# EAGLE schematic usb-digital-out (EAGLE 6.4)
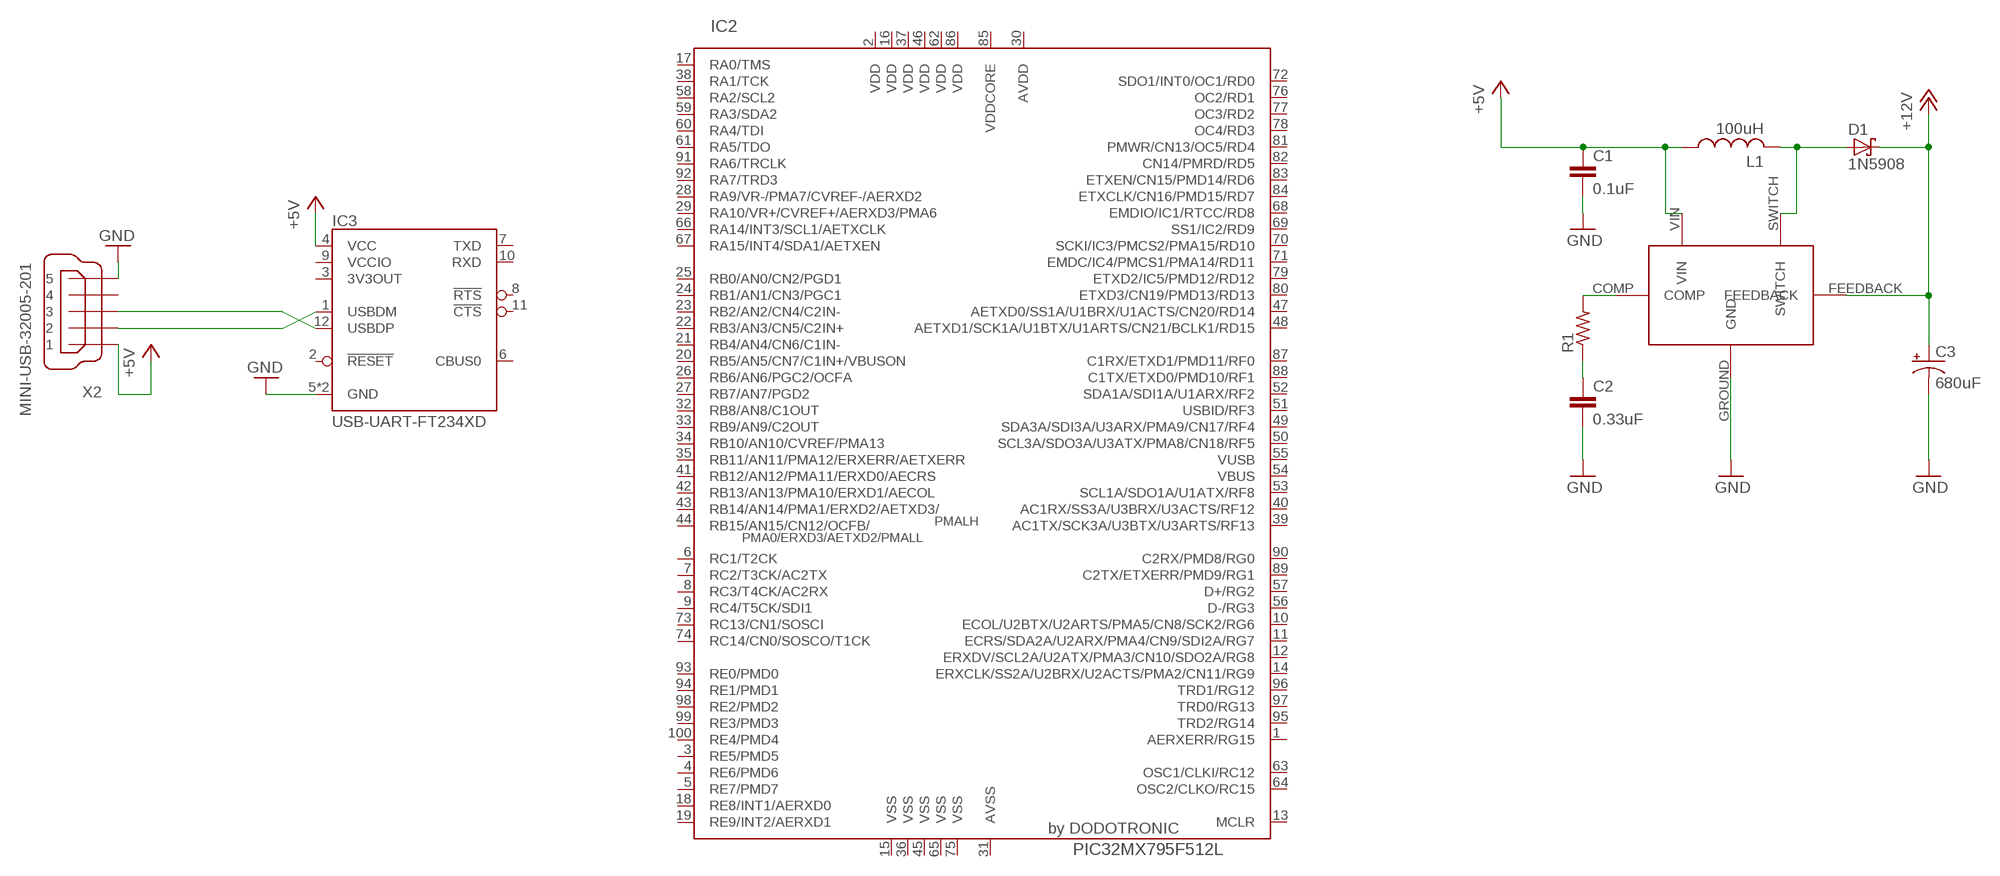
[diagram p0: schematic, sheet 1]

## Parts
C1  0.1uF  C-EUC0805K  [C0805K]
C2  0.33uF  C-EUC0805K  [C0805K]
C3  680uF  CPOL-USC/6032-28R  [C/6032-28R]
D1  1N5908  [C4111-15]
IC2  PIC32MX795F512L  [TQFP100_14X14]
IC3  USB-UART-FT234XD  [DFN-12-(3X3)]
L1  100uH  L-USL4532P  [L4532P]
R1  R-US_M0805  [M0805]
U$1  LM2577  [DDPAK-5]
X2  MINI-USB-32005-201  [32005-201]

## Nets
+5V: C1.1 IC3.4(VCC) L1.1 U$1.VIN X2.1
+12V: C3.+ D1.C U$1.FEEDBACK
GND: C1.2 C2.2 C3.- IC3.5(GND) IC3.THERMAL-PAD(GND) U$1.GROUND(GND) X2.5
N$1: C2.1 R1.1
N$2: R1.2 U$1.COMP
N$3: D1.A L1.2 U$1.SWITCH
N$4: IC3.1(USBDM) X2.2
N$5: IC3.12(USBDP) X2.3
Unconnected: IC2.1(AERXERR/RG15) IC2.3(RE5/PMD5) IC2.4(RE6/PMD6) IC2.5(RE7/PMD7) IC2.6(RC1/T2CK) IC2.7(RC2/T3CK/AC2TX) IC2.8(RC3/T4CK/AC2RX) IC2.9(RC4/T5CK/SDI1) IC2.10(ECOL/U2BTX/U2ARTS/PMA5/CN8/SCK2/RG6) IC2.11(ECRS/SDA2A/U2ARX/PMA4/CN9/SDI2A/RG7) IC2.12(ERXDV/SCL2A/U2ATX/PMA3/CN10/SDO2A/RG8) IC2.13(MCLR) IC2.14(ERXCLK/SS2A/U2BRX/U2ACTS/PMA2/CN11/RG9) IC2.17(RA0/TMS) IC2.18(RE8/INT1/AERXD0) IC2.19(RE9/INT2/AERXD1) IC2.20(RB5/AN5/CN7/C1IN+/VBUSON) IC2.21(RB4/AN4/CN6/C1IN-) IC2.22(RB3/AN3/CN5/C2IN+) IC2.23(RB2/AN2/CN4/C2IN-) IC2.24(RB1/AN1/CN3/PGC1) IC2.25(RB0/AN0/CN2/PGD1) IC2.26(RB6/AN6/PGC2/OCFA) IC2.27(RB7/AN7/PGD2) IC2.28(RA9/VR-/PMA7/CVREF-/AERXD2) IC2.29(RA10/VR+/CVREF+/AERXD3/PMA6) IC2.30(AVDD) IC2.31(AVSS) IC2.32(RB8/AN8/C1OUT) IC2.33(RB9/AN9/C2OUT) IC2.34(RB10/AN10/CVREF/PMA13) IC2.35(RB11/AN11/PMA12/ERXERR/AETXERR) IC2.38(RA1/TCK) IC2.39(AC1TX/SCK3A/U3BTX/U3ARTS/RF13) IC2.40(AC1RX/SS3A/U3BRX/U3ACTS/RF12) IC2.41(RB12/AN12/PMA11/ERXD0/AECRS) IC2.42(RB13/AN13/PMA10/ERXD1/AECOL) IC2.43(RB14/AN14/PMA1/ERXD2/AETXD3/) IC2.44(RB15/AN15/CN12/OCFB/) IC2.47(AETXD0/SS1A/U1BRX/U1ACTS/CN20/RD14) IC2.48(AETXD1/SCK1A/U1BTX/U1ARTS/CN21/BCLK1/RD15) IC2.49(SDA3A/SDI3A/U3ARX/PMA9/CN17/RF4) IC2.50(SCL3A/SDO3A/U3ATX/PMA8/CN18/RF5) IC2.51(USBID/RF3) IC2.52(SDA1A/SDI1A/U1ARX/RF2) IC2.53(SCL1A/SDO1A/U1ATX/RF8) IC2.54(VBUS) IC2.55(VUSB) IC2.56(D-/RG3) IC2.57(D+/RG2) IC2.58(RA2/SCL2) IC2.59(RA3/SDA2) IC2.60(RA4/TDI) IC2.61(RA5/TDO) IC2.63(OSC1/CLKI/RC12) IC2.64(OSC2/CLKO/RC15) IC2.66(RA14/INT3/SCL1/AETXCLK) IC2.67(RA15/INT4/SDA1/AETXEN) IC2.68(EMDIO/IC1/RTCC/RD8) IC2.69(SS1/IC2/RD9) IC2.70(SCKI/IC3/PMCS2/PMA15/RD10) IC2.71(EMDC/IC4/PMCS1/PMA14/RD11) IC2.72(SDO1/INT0/OC1/RD0) IC2.73(RC13/CN1/SOSCI) IC2.74(RC14/CN0/SOSCO/T1CK) IC2.76(OC2/RD1) IC2.77(OC3/RD2) IC2.78(OC4/RD3) IC2.79(ETXD2/IC5/PMD12/RD12) IC2.80(ETXD3/CN19/PMD13/RD13) IC2.81(PMWR/CN13/OC5/RD4) IC2.82(CN14/PMRD/RD5) IC2.83(ETXEN/CN15/PMD14/RD6) IC2.84(ETXCLK/CN16/PMD15/RD7) IC2.85(VDDCORE) IC2.87(C1RX/ETXD1/PMD11/RF0) IC2.88(C1TX/ETXD0/PMD10/RF1) IC2.89(C2TX/ETXERR/PMD9/RG1) IC2.90(C2RX/PMD8/RG0) IC2.91(RA6/TRCLK) IC2.92(RA7/TRD3) IC2.93(RE0/PMD0) IC2.94(RE1/PMD1) IC2.95(TRD2/RG14) IC2.96(TRD1/RG12) IC2.97(TRD0/RG13) IC2.98(RE2/PMD2) IC2.99(RE3/PMD3) IC2.100(RE4/PMD4) IC3.2(!RESET) IC3.6(CBUS0) IC3.7(TXD) IC3.8(!RTS) IC3.10(RXD) IC3.11(!CTS) X2.4

## Power pins joined to a net without a drawn wire
3V3OUT: IC3.3(3V3OUT)
VCCIO: IC3.9(VCCIO)
VDD: IC2.2(VDD) IC2.16(VDD) IC2.37(VDD) IC2.46(VDD) IC2.62(VDD) IC2.86(VDD)
VSS: IC2.15(VSS) IC2.36(VSS) IC2.45(VSS) IC2.65(VSS) IC2.75(VSS)

## Library data of the parts
C1 C2 = resistor:C-EU: CAPACITOR, European symbol
C3 = resistor:CPOL-US: POLARIZED CAPACITOR, American symbol
D1 = diode:1N5908: DIODE schottky
IC2 = DodoMicroR3:PIC32MX795F512: USB, CAN and Ethernet 32-bit Flash Microcontroller
IC3 = 11-egna-ic:USB-UART-FT234XD
L1 = resistor:L-US: INDUCTOR, American symbol
R1 = resistor:R-US_: RESISTOR, American symbol
U$1 = nusolar_components:LM2577
X2 = con-cypressindustries:MINI-USB-: MINI USB-B Conector Source: www.cypressindustries.com; OC_FARNELL: unknown; OC_NEWARK: unknown